# Altium schematic sheet 12vOutputs.SchDoc: 12V Outputs
size A; DrawnBy: Andrew Pobrica; DocumentNumber: 2; SheetNumber: 2; SheetTotal: 7
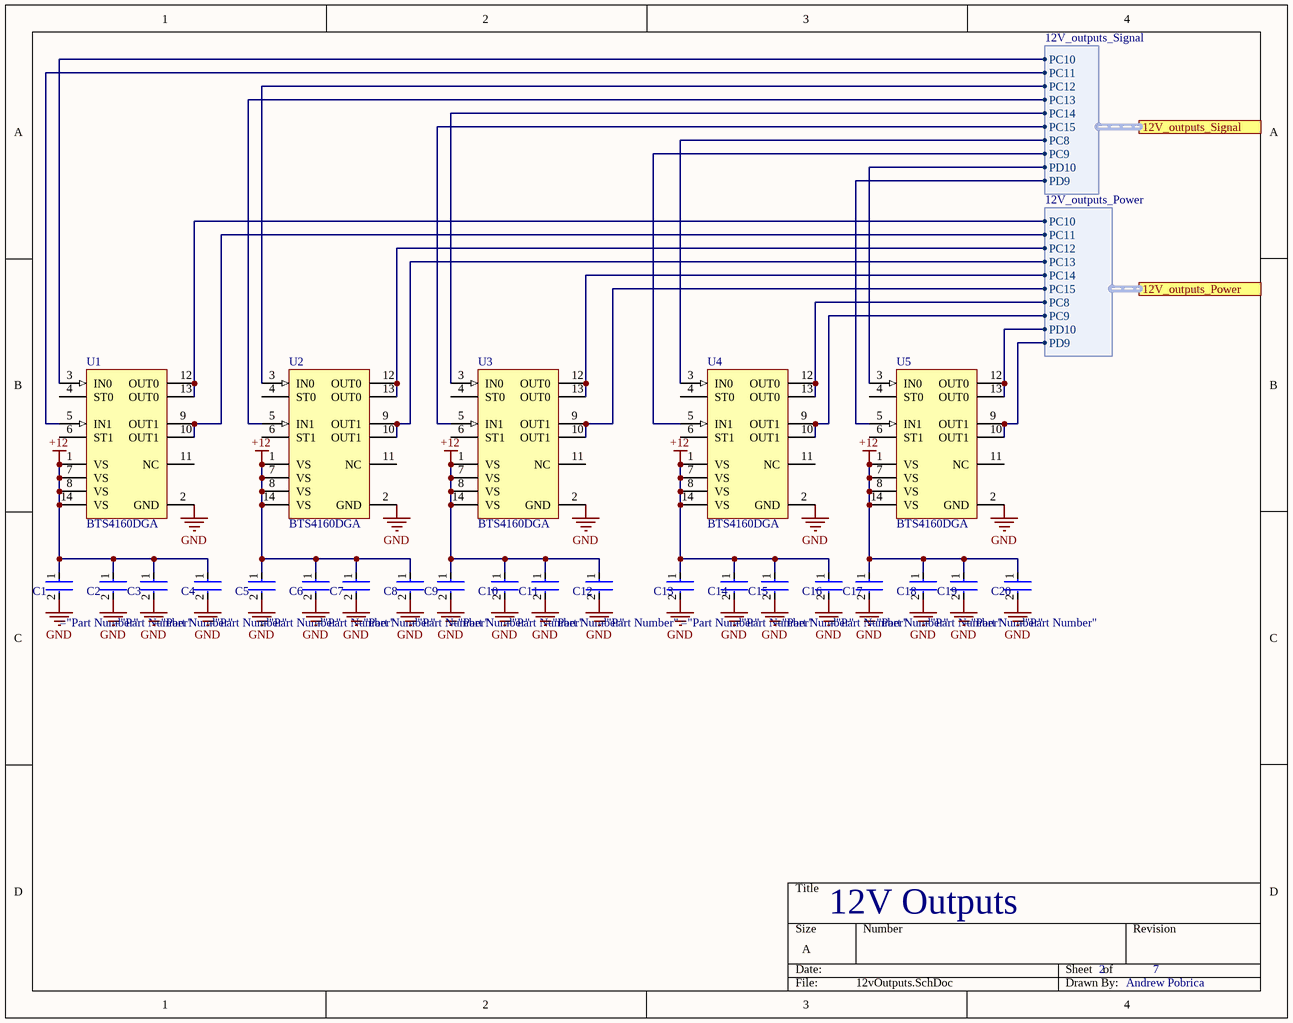
[diagram p0: 12vOutputs.SchDoc]

## Parts
C1  C0603C104K5RACTU  [Kemet_C0805_IPC_A]  (value not drawn)
C2  C0603C104K5RACTU  [Kemet_C0805_IPC_A]  (value not drawn)
C3  C0603C104K5RACTU  [Kemet_C0805_IPC_A]  (value not drawn)
C4  C0603C104K5RACTU  [Kemet_C0805_IPC_A]  (value not drawn)
C5  C0603C104K5RACTU  [Kemet_C0805_IPC_A]  (value not drawn)
C6  C0603C104K5RACTU  [Kemet_C0805_IPC_A]  (value not drawn)
C7  C0603C104K5RACTU  [Kemet_C0805_IPC_A]  (value not drawn)
C8  C0603C104K5RACTU  [Kemet_C0805_IPC_A]  (value not drawn)
C9  C0603C104K5RACTU  [Kemet_C0805_IPC_A]  (value not drawn)
C10  C0603C104K5RACTU  [Kemet_C0805_IPC_A]  (value not drawn)
C11  C0603C104K5RACTU  [Kemet_C0805_IPC_A]  (value not drawn)
C12  C0603C104K5RACTU  [Kemet_C0805_IPC_A]  (value not drawn)
C13  C0603C104K5RACTU  [Kemet_C0805_IPC_A]  (value not drawn)
C14  C0603C104K5RACTU  [Kemet_C0805_IPC_A]  (value not drawn)
C15  C0603C104K5RACTU  [Kemet_C0805_IPC_A]  (value not drawn)
C16  C0603C104K5RACTU  [Kemet_C0805_IPC_A]  (value not drawn)
C17  C0603C104K5RACTU  [Kemet_C0805_IPC_A]  (value not drawn)
C18  C0603C104K5RACTU  [Kemet_C0805_IPC_A]  (value not drawn)
C19  C0603C104K5RACTU  [Kemet_C0805_IPC_A]  (value not drawn)
C20  C0603C104K5RACTU  [Kemet_C0805_IPC_A]  (value not drawn)
U1  BTS4160DGA  [INF-PG-DSO-14-37_N]
U2  BTS4160DGA  [INF-PG-DSO-14-37_N]
U3  BTS4160DGA  [INF-PG-DSO-14-37_N]
U4  BTS4160DGA  [INF-PG-DSO-14-37_N]
U5  BTS4160DGA  [INF-PG-DSO-14-37_N]

## Ports
12V_outputs_Power (harness 12V_outputs_Power), 12V_outputs_Signal (harness 12V_outputs_Signal)

## Harnesses
12V_outputs_Power: PC10, PC11, PC12, PC13, PC14, PC15, PC8, PC9, PD10, PD9
12V_outputs_Signal: PC10, PC11, PC12, PC13, PC14, PC15, PC8, PC9, PD10, PD9

## Nets
+12: C1.1 C2.1 C3.1 C4.1 C5.1 C6.1 C7.1 C8.1 C9.1 C10.1 C11.1 C12.1 C13.1 C14.1 C15.1 C16.1 C17.1 C18.1 C19.1 C20.1 U1.1(VS) U1.7(VS) U1.8(VS) U1.14(VS) U2.1(VS) U2.7(VS) U2.8(VS) U2.14(VS) U3.1(VS) U3.7(VS) U3.8(VS) U3.14(VS) U4.1(VS) U4.7(VS) U4.8(VS) U4.14(VS) U5.1(VS) U5.7(VS) U5.8(VS) U5.14(VS)
GND: C1.2 C2.2 C3.2 C4.2 C5.2 C6.2 C7.2 C8.2 C9.2 C10.2 C11.2 C12.2 C13.2 C14.2 C15.2 C16.2 C17.2 C18.2 C19.2 C20.2 U1.2(GND) U2.2(GND) U3.2(GND) U4.2(GND) U5.2(GND)
NetU1_3: U1.3(IN0) ; port 12V_outputs_Signal.PC10
NetU1_5: U1.5(IN1) ; port 12V_outputs_Signal.PC11
NetU1_9: U1.9(OUT1) U1.10(OUT1) ; port 12V_outputs_Power.PC11
NetU1_12: U1.12(OUT0) U1.13(OUT0) ; port 12V_outputs_Power.PC10
NetU2_3: U2.3(IN0) ; port 12V_outputs_Signal.PC12
NetU2_5: U2.5(IN1) ; port 12V_outputs_Signal.PC13
NetU2_9: U2.9(OUT1) U2.10(OUT1) ; port 12V_outputs_Power.PC13
NetU2_12: U2.12(OUT0) U2.13(OUT0) ; port 12V_outputs_Power.PC12
NetU3_3: U3.3(IN0) ; port 12V_outputs_Signal.PC14
NetU3_5: U3.5(IN1) ; port 12V_outputs_Signal.PC15
NetU3_9: U3.9(OUT1) U3.10(OUT1) ; port 12V_outputs_Power.PC15
NetU3_12: U3.12(OUT0) U3.13(OUT0) ; port 12V_outputs_Power.PC14
NetU4_3: U4.3(IN0) ; port 12V_outputs_Signal.PC8
NetU4_5: U4.5(IN1) ; port 12V_outputs_Signal.PC9
NetU4_9: U4.9(OUT1) U4.10(OUT1) ; port 12V_outputs_Power.PC9
NetU4_12: U4.12(OUT0) U4.13(OUT0) ; port 12V_outputs_Power.PC8
NetU5_3: U5.3(IN0) ; port 12V_outputs_Signal.PD10
NetU5_5: U5.5(IN1) ; port 12V_outputs_Signal.PD9
NetU5_9: U5.9(OUT1) U5.10(OUT1) ; port 12V_outputs_Power.PD9
NetU5_12: U5.12(OUT0) U5.13(OUT0) ; port 12V_outputs_Power.PD10

Not connected (* = marked no-connect by the designer): U1 4(ST0) 6(ST1) 11(NC); U2 4(ST0) 6(ST1) 11(NC); U3 4(ST0) 6(ST1) 11(NC); U4 4(ST0) 6(ST1) 11(NC); U5 4(ST0) 6(ST1) 11(NC)

## Library data of the parts
U1-U5 = BTS4160DGA: Smart High-Side Power Switch, 2 Channels, 1.7 A Load Current, -40 to 150 degC, PG-DSO-14-37, Reel, Green; Manufacturer: Infineon; Group: Automotive Qualified; RON(max) @ 150degreesC: 320 mOhm; Recommended Operating Voltage Min.: 5.5 V; Recommended Operating Voltage Max.: 20 V; Green: TRUE; toff (max): 270 us; Load Current (typ): 1.7 A; ton (max): 250 us; RON @ 25degreesC: 160 mOhm; Ptot (max): 1.4 W; Channels: 2; PartNumber: BTS4160DGA; ComponentLink1Description: Manufacturer URL; ComponentLink2Description: Datasheet; DatasheetVersion: Rev. 1.0; ComponentLink3URL: http://www.infineon.com/dgdl/BTS723GWDS11_2007_09_25.pdf?folderId=db3a304314dca389011537739e37155f&fileId=db3a304331c8f8560131dbfec21b0da9&sId=db3a30443d67b5ca013d854df2f133e5; ComponentLink1URL: http://www.infineon.com/; Packing: Reel; ComponentLink2URL: http://www.infineon.com/dgdl/BTS+4160DGA_DS2008_03_18_neu.pdf?folderId=db3a304314dca389011537739e37155f&fileId=db3a30431a5c32f2011a957ab5875685&sId=db3a30433d68e984013d7cba76cc57cb; ComponentLink3Description: Package Specification; PackageVersion: Sep-07; Halogen-free: TRUE; Mounting Technology: Surface Mount; PackageReference: PG-DSO-14-37; PackageDescription: 14-Pin Plastic (Green) Dual Small Outline Package, 8.65 x 3.9 mm Body, 1.27 mm Pitch